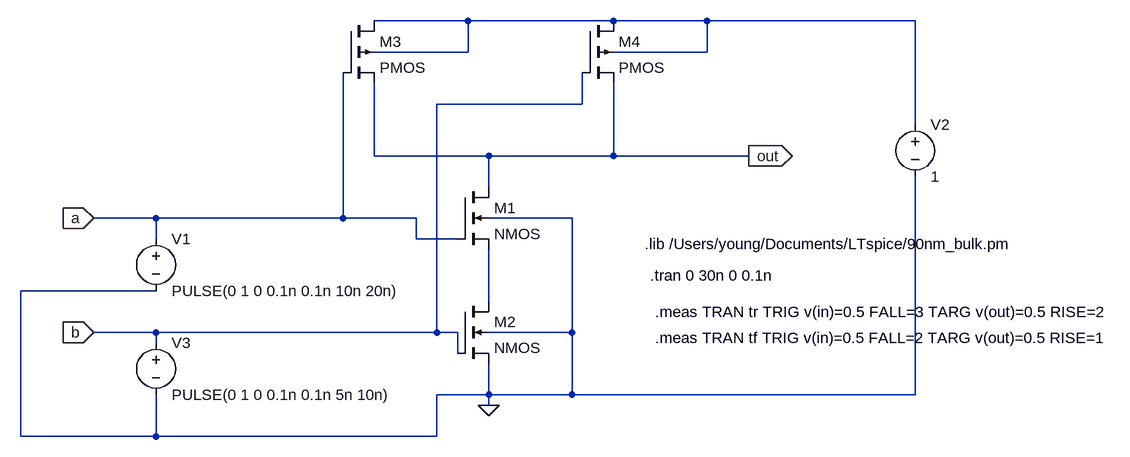
[diagram p0: schematic nand.asc]
nand.asc, the LTspice schematic file:
Version 4
SHEET 1 1244 680
WIRE 272 -32 128 -32
WIRE 496 -32 272 -32
WIRE 640 -32 496 -32
WIRE 960 -32 640 -32
WIRE 272 16 272 -32
WIRE 272 16 128 16
WIRE 640 16 640 -32
WIRE 640 16 496 16
WIRE 448 96 448 48
WIRE 448 96 224 96
WIRE 960 128 960 -32
WIRE 128 176 128 64
WIRE 304 176 128 176
WIRE 496 176 496 64
WIRE 496 176 304 176
WIRE 704 176 496 176
WIRE 304 224 304 176
WIRE -208 272 -304 272
WIRE 80 272 80 48
WIRE 80 272 -208 272
WIRE 192 272 80 272
WIRE 432 272 304 272
WIRE -208 304 -208 272
WIRE 192 304 192 272
WIRE 256 304 192 304
WIRE -208 384 -416 384
WIRE 304 400 304 320
WIRE -208 448 -304 448
WIRE 224 448 224 96
WIRE 224 448 -208 448
WIRE 256 448 224 448
WIRE 432 448 432 272
WIRE 432 448 304 448
WIRE -208 464 -208 448
WIRE 256 480 256 448
WIRE 304 544 304 496
WIRE 304 544 224 544
WIRE 432 544 432 448
WIRE 432 544 304 544
WIRE 960 544 960 208
WIRE 960 544 432 544
WIRE 304 560 304 544
WIRE -416 608 -416 384
WIRE -208 608 -208 544
WIRE -208 608 -416 608
WIRE 224 608 224 544
WIRE 224 608 -208 608
FLAG 704 176 out
IOPIN 704 176 Out
FLAG -304 272 a
IOPIN -304 272 In
FLAG -304 448 b
IOPIN -304 448 In
FLAG 304 560 0
SYMBOL nmos4 256 224 R0
SYMATTR InstName M1
SYMATTR Value2 l=200n w=200n
SYMBOL nmos4 256 400 R0
SYMATTR InstName M2
SYMATTR Value2 l=200n w=200n
SYMBOL pmos4 80 -32 R0
SYMATTR InstName M3
SYMATTR Value2 l=200n w=400n
SYMBOL pmos4 448 -32 R0
SYMATTR InstName M4
SYMATTR Value2 l=200n w=400n
SYMBOL voltage -208 288 R0
WINDOW 123 0 0 Left 0
WINDOW 39 0 0 Left 0
SYMATTR InstName V1
SYMATTR Value PULSE(0 1 0 0.1n 0.1n 10n 20n)
SYMBOL voltage 960 112 R0
WINDOW 123 0 0 Left 0
WINDOW 39 0 0 Left 0
SYMATTR InstName V2
SYMATTR Value 1
SYMBOL voltage -208 448 R0
WINDOW 123 0 0 Left 0
WINDOW 39 0 0 Left 0
SYMATTR InstName V3
SYMATTR Value PULSE(0 1 0 0.1n 0.1n 5n 10n)
TEXT 544 312 Left 2 !.lib /Users/young/Documents/LTspice/90nm_bulk.pm
TEXT 552 360 Left 2 !.tran 0 30n 0 0.1n
TEXT 560 416 Left 2 !.meas TRAN tr TRIG v(in)=0.5 FALL=3 TARG v(out)=0.5 RISE=2
TEXT 560 456 Left 2 !.meas TRAN tf TRIG v(in)=0.5 FALL=2 TARG v(out)=0.5 RISE=1

The netlist it stands for:
* nand.asc
M1 out a N002 0 NMOS l=200n w=200n
M2 N002 b 0 0 NMOS l=200n w=200n
M3 N001 a out N001 PMOS l=200n w=400n
M4 N001 b out N001 PMOS l=200n w=400n
V1 a 0 PULSE(0 1 0 0.1n 0.1n 10n 20n)
V2 N001 0 1
V3 b 0 PULSE(0 1 0 0.1n 0.1n 5n 10n)
.model NMOS NMOS
.model PMOS PMOS
.lib standard.mos
.lib /Users/young/Documents/LTspice/90nm_bulk.pm
.tran 0 30n 0 0.1n
.meas TRAN tr TRIG v(in)=0.5 FALL=3 TARG v(out)=0.5 RISE=2
.meas TRAN tf TRIG v(in)=0.5 FALL=2 TARG v(out)=0.5 RISE=1
.backanno
.end